# Altium schematic sheet 20 WiFi_BT.SchDoc
size 420 x 297 mm; Address1: Address1; Address2: Address2; Address3: Address3; Address4: Address4; DocumentNumber: АБВГ.123456.001 Э3; SheetNumber: 20; SheetTotal: 23; Scale: 1:1; DocumentType: Схема электрическая принципиальная; FirstReferrence: АБВГ.123456.001
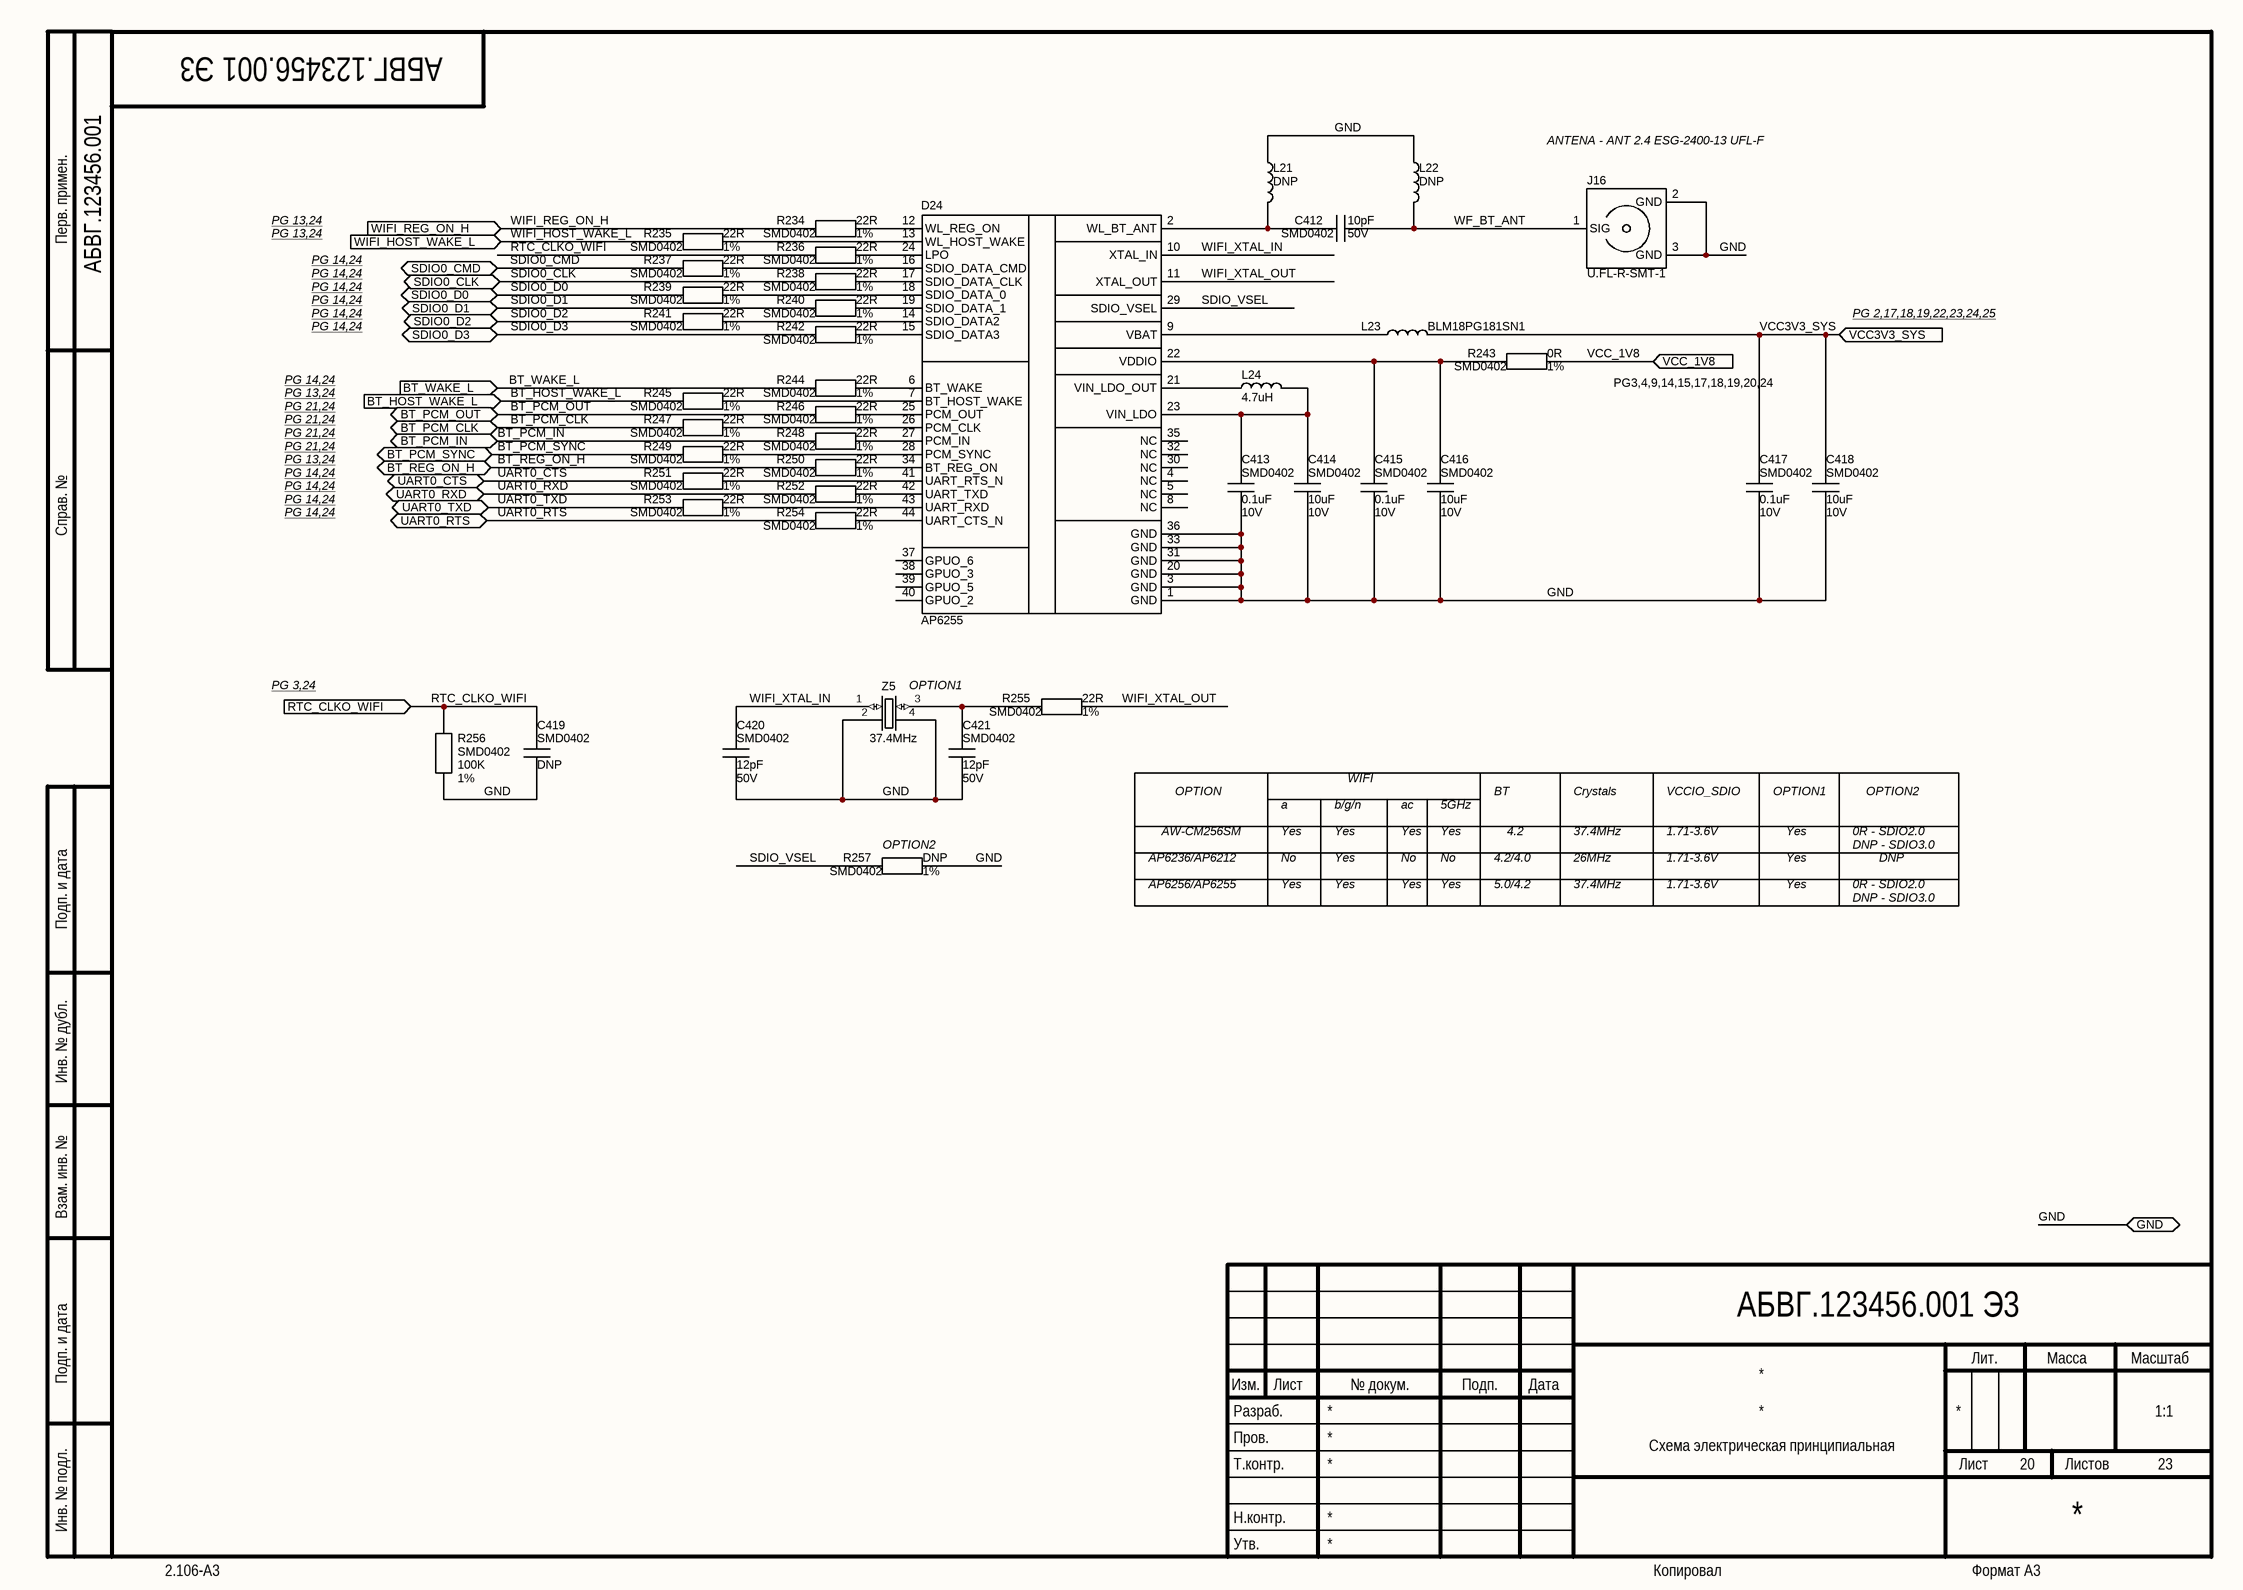
[diagram p0: 20 WiFi_BT.SchDoc]

## Parts
C412  Package: SMD0402  Voltage: 50V  [CAP_SMD_0402]  (hidden comment: 10pF)
C413  Package: SMD0402  Voltage: 10V  [CAP_SMD_0402]  (hidden comment: 0.1uF)
C414  Package: SMD0402  Voltage: 10V  [CAP_SMD_0402]  (hidden comment: 10uF)
C415  Package: SMD0402  Voltage: 10V  [CAP_SMD_0402]  (hidden comment: 0.1uF)
C416  Package: SMD0402  Voltage: 10V  [CAP_SMD_0402]  (hidden comment: 10uF)
C417  Package: SMD0402  Voltage: 10V  [CAP_SMD_0402]  (hidden comment: 0.1uF)
C418  Package: SMD0402  Voltage: 10V  [CAP_SMD_0402]  (hidden comment: 10uF)
C419  Package: SMD0402  [CAP_SMD_0402]  (hidden comment: DNP)
C420  Package: SMD0402  Voltage: 50V  [CAP_SMD_0402]  (hidden comment: 12pF)
C421  Package: SMD0402  Voltage: 50V  [CAP_SMD_0402]  (hidden comment: 12pF)
D24  AP6255  [AP6255]
J16  U.FL-R-SMT-1  [U.FL-R-SMT-1]
L21  value DNP  [IND_SMD_0402]  (hidden comment: Value)
L22  value DNP  [IND_SMD_0402]  (hidden comment: Value)
L23  value BLM18PG181SN1  [IND_SMD_0603]  (hidden comment: Value)
L24  value 4.7uH  [MWSA0402S]  (hidden comment: Value)
R234  Package: SMD0402  Tolerance: 1%  [RES_SMD_0402]  (hidden comment: 22R)
R235  Package: SMD0402  Tolerance: 1%  [RES_SMD_0402]  (hidden comment: 22R)
R236  Package: SMD0402  Tolerance: 1%  [RES_SMD_0402]  (hidden comment: 22R)
R237  Package: SMD0402  Tolerance: 1%  [RES_SMD_0402]  (hidden comment: 22R)
R238  Package: SMD0402  Tolerance: 1%  [RES_SMD_0402]  (hidden comment: 22R)
R239  Package: SMD0402  Tolerance: 1%  [RES_SMD_0402]  (hidden comment: 22R)
R240  Package: SMD0402  Tolerance: 1%  [RES_SMD_0402]  (hidden comment: 22R)
R241  Package: SMD0402  Tolerance: 1%  [RES_SMD_0402]  (hidden comment: 22R)
R242  Package: SMD0402  Tolerance: 1%  [RES_SMD_0402]  (hidden comment: 22R)
R243  Package: SMD0402  Tolerance: 1%  [RES_SMD_0402]  (hidden comment: 0R)
R244  Package: SMD0402  Tolerance: 1%  [RES_SMD_0402]  (hidden comment: 22R)
R245  Package: SMD0402  Tolerance: 1%  [RES_SMD_0402]  (hidden comment: 22R)
R246  Package: SMD0402  Tolerance: 1%  [RES_SMD_0402]  (hidden comment: 22R)
R247  Package: SMD0402  Tolerance: 1%  [RES_SMD_0402]  (hidden comment: 22R)
R248  Package: SMD0402  Tolerance: 1%  [RES_SMD_0402]  (hidden comment: 22R)
R249  Package: SMD0402  Tolerance: 1%  [RES_SMD_0402]  (hidden comment: 22R)
R250  Package: SMD0402  Tolerance: 1%  [RES_SMD_0402]  (hidden comment: 22R)
R251  Package: SMD0402  Tolerance: 1%  [RES_SMD_0402]  (hidden comment: 22R)
R252  Package: SMD0402  Tolerance: 1%  [RES_SMD_0402]  (hidden comment: 22R)
R253  Package: SMD0402  Tolerance: 1%  [RES_SMD_0402]  (hidden comment: 22R)
R254  Package: SMD0402  Tolerance: 1%  [RES_SMD_0402]  (hidden comment: 22R)
R255  Package: SMD0402  Tolerance: 1%  [RES_SMD_0402]  (hidden comment: 22R)
R256  Package: SMD0402  Tolerance: 1%  [RES_SMD_0402]  (hidden comment: 100K)
R257  Package: SMD0402  Tolerance: 1%  [RES_SMD_0402]  (hidden comment: DNP)
Z5  value 37.4MHz  [TSX3225]  (hidden comment: Value)

## Ports
BT_HOST_WAKE_L (in), BT_PCM_CLK (bidir), BT_PCM_IN (bidir), BT_PCM_OUT (bidir), BT_PCM_SYNC (bidir), BT_REG_ON_H (bidir), BT_WAKE_L (in), GND (bidir), RTC_CLKO_WIFI (in), SDIO0_CLK (bidir), SDIO0_CMD (bidir), SDIO0_D0 (bidir), SDIO0_D1 (bidir), SDIO0_D2 (bidir), SDIO0_D3 (bidir), UART0_CTS (bidir), UART0_RTS (bidir), UART0_RXD (bidir), UART0_TXD (bidir), VCC3V3_SYS (in), VCC_1V8 (in), WIFI_HOST_WAKE_L (in), WIFI_REG_ON_H (in)

## Nets
BT_HOST_WAKE_L: R245.1 ; port BT_HOST_WAKE_L
BT_PCM_CLK: R247.1 ; port BT_PCM_CLK
BT_PCM_IN: R248.1 ; port BT_PCM_IN
BT_PCM_OUT: R246.1 ; port BT_PCM_OUT
BT_PCM_SYNC: R249.1 ; port BT_PCM_SYNC
BT_REG_ON_H: R250.1 ; port BT_REG_ON_H
BT_WAKE_L: R244.1 ; port BT_WAKE_L
GND: C413.2 C414.2 C415.2 C416.2 C417.2 C418.2 C419.1 C420.2 C421.2 D24.1(GND) D24.3(GND) D24.20(GND) D24.31(GND) D24.33(GND) D24.36(GND) J16.2(GND) J16.3(GND) L21.2 L22.2 R256.1 R257.2 Z5.2(GND) Z5.4(GND) ; port GND
RTC_CLKO_WIFI: C419.2 R236.1 R256.2 ; port RTC_CLKO_WIFI
SDIO0_CLK: R238.1 ; port SDIO0_CLK
SDIO0_CMD: R237.1 ; port SDIO0_CMD
SDIO0_D0: R239.1 ; port SDIO0_D0
SDIO0_D1: R240.1 ; port SDIO0_D1
SDIO0_D2: R241.1 ; port SDIO0_D2
SDIO0_D3: R242.1 ; port SDIO0_D3
SDIO_VSEL: D24.29(SDIO_VSEL) R257.1
UART0_CTS: R251.1 ; port UART0_CTS
UART0_RTS: R254.1 ; port UART0_RTS
UART0_RXD: R252.1 ; port UART0_RXD
UART0_TXD: R253.1 ; port UART0_TXD
VCC3V3_SYS: C417.1 C418.1 L23.1 ; port VCC3V3_SYS
VCC_1V8: R243.2 ; port VCC_1V8
WF_BT_ANT: C412.2 J16.1(SIG) L22.1
WIFI_HOST_WAKE_L: R235.1 ; port WIFI_HOST_WAKE_L
WIFI_REG_ON_H: R234.1 ; port WIFI_REG_ON_H
WIFI_XTAL_IN: C420.1 D24.10(XTAL_IN) Z5.1(IN/OUT)
WIFI_XTAL_OUT: D24.11(XTAL_OUT) R255.2
NetC412_1: C412.1 D24.2(WL_BT_ANT) L21.1
NetC413_1: C413.1 C414.1 D24.23(VIN_LDO) L24.1
NetC415_1: C415.1 C416.1 D24.22(VDDIO) R243.1
NetC421_1: C421.1 R255.1 Z5.3(IN/OUT)
NetD24_6: D24.6(BT_WAKE) R244.2
NetD24_7: D24.7(BT_HOST_WAKE) R245.2
NetD24_9: D24.9(VBAT) L23.2
NetD24_12: D24.12(WL_REG_ON) R234.2
NetD24_13: D24.13(WL_HOST_WAKE) R235.2
NetD24_14: D24.14(SDIO_DATA2) R241.2
NetD24_15: D24.15(SDIO_DATA3) R242.2
NetD24_16: D24.16(SDIO_DATA_CMD) R237.2
NetD24_17: D24.17(SDIO_DATA_CLK) R238.2
NetD24_18: D24.18(SDIO_DATA_0) R239.2
NetD24_19: D24.19(SDIO_DATA_1) R240.2
NetD24_21: D24.21(VIN_LDO_OUT) L24.2
NetD24_24: D24.24(LPO) R236.2
NetD24_25: D24.25(PCM_OUT) R246.2
NetD24_26: D24.26(PCM_CLK) R247.2
NetD24_27: D24.27(PCM_IN) R248.2
NetD24_28: D24.28(PCM_SYNC) R249.2
NetD24_34: D24.34(BT_REG_ON) R250.2
NetD24_41: D24.41(UART_RTS_N) R251.2
NetD24_42: D24.42(UART_TXD) R252.2
NetD24_43: D24.43(UART_RXD) R253.2
NetD24_44: D24.44(UART_CTS_N) R254.2

Not connected (* = marked no-connect by the designer): D24 4(NC) 5(NC) 8(NC) 30(NC) 32(NC) 35(NC) 37(GPUO_6) 38(GPUO_3) 39(GPUO_5) 40(GPUO_2)

## Notes on the sheet
- (near J16) ANTENA - ANT 2.4 ESG-2400-13 UFL-F
- Перв. примен.
- PG 13,24
- PG 14,24
- PG 2,17,18,19,22,23,24,25
- PG 21,24
- PG3,4,9,14,15,17,18,19,20,24
- Справ. №
- PG 3,24
- (near Z5) OPTION1
- OPTION
- WIFI
- BT
- Crystals
- VCCIO_SDIO
- OPTION1
- OPTION2
- (near R257) OPTION2
- AP6236/AP6212
- AW-CM256SM
- a
- Yes
- No
- b/g/n
- ac
- 5GHz
- 4.2/4.0
- 4.2
- 37.4MHz
- 26MHz
- 1.71-3.6V
- 0R - SDIO2.0
- DNP - SDIO3.0
- DNP
- Подп. и дата
- AP6256/AP6255
- 5.0/4.2
- Инв. № дубл.
- Взам. инв. №
- Разраб.
- Изм.
- Лист
- № докум.
- Подп.
- Дата
- Лит.
- Масса
- Масштаб
- Пров.
- Т.контр.
- Листов
- Инв. № подл.
- Утв.
- Н.контр.
- 2.106-A3
- Копировал
- Формат А3

## Library data of the parts
C412 = Ceramic_Cap: PartNumber: CC0402CRNPO9BN100; ComponentType: SMD Ceramic Chip Capacitor; Manufacter: *; Tolerance: *; ClassName: *; Value: 10pF
C413 C415 C417 = Ceramic_Cap: PartNumber: CC0402KRX5R6BB104; ComponentType: SMD Ceramic Chip Capacitor; Manufacter: *; Tolerance: *; ClassName: *; Value: 0.1uF
C414 C416 C418 = Ceramic_Cap: PartNumber: CC0402MRX5R6BB106; ComponentType: SMD Ceramic Chip Capacitor; Manufacter: *; Tolerance: *; ClassName: *; Value: 10uF
C419 = Ceramic_Cap: PartNumber: Do Not Place; ComponentType: SMD Ceramic Chip Capacitor; Manufacter: *; Tolerance: *; ClassName: *; Value: DNP; Voltage: *
C420 C421 = Ceramic_Cap: PartNumber: CC0402JRNPO9BN120; ComponentType: SMD Ceramic Chip Capacitor; Manufacter: *; Tolerance: *; ClassName: *; Value: 12pF
J16 = UFL_CON: ComponentType: SMD Chip Resistor; Manufacter: *; Voltage: *; ClassName: *; Tolerance: *; PartNumber: U.FL-R-SMT-1; Package: U.FL-R-SMT-1; Value: U.FL-R-SMT-1
L21 L22 = Inductor_smal: PartNumber: Do Not Place; ComponentType: *; Manufacter: *; Package: SMD0402; ClassName: Solder_Clearence
L23 = Inductor_smal: ComponentType: *; Manufacter: *; Package: SMD0603; PartNumber: BLM18PG181SN1; ClassName: *
L24 = Inductor_smal: PartNumber: MWSA0402S-4R7MT; ComponentType: *; Manufacter: *; Package: MWSA0402S; ClassName: *
R234-R242 R244-R255 = Chip_Res: PartNumber: RC0402FR-0722RL; ComponentType: SMD Chip Resistor; Manufacter: *; Voltage: *; ClassName: *; Value: 22R
R243 = Chip_Res: PartNumber: RC0402FR-070RL; ComponentType: SMD Chip Resistor; Manufacter: *; Voltage: *; ClassName: *; Value: 0R
R256 = Chip_Res: PartNumber: RC0402FR-07100KL; ComponentType: SMD Chip Resistor; Manufacter: *; Voltage: *; ClassName: *; Value: 100K
R257 = Chip_Res: PartNumber: Do Not Place; ComponentType: SMD Chip Resistor; Manufacter: *; Voltage: *; ClassName: *; Value: DNP
Z5 = OSC3225: PartNumber: X3225374MOB4SI; ComponentType: *; Manufacter: *; Package: TSX3225
D24 = AP6255: ComponentType: SMD Chip Resistor; Manufacter: *; Voltage: *; ClassName: *; Tolerance: *; PartNumber: AP6255; Package: AP6255; Value: AP6255